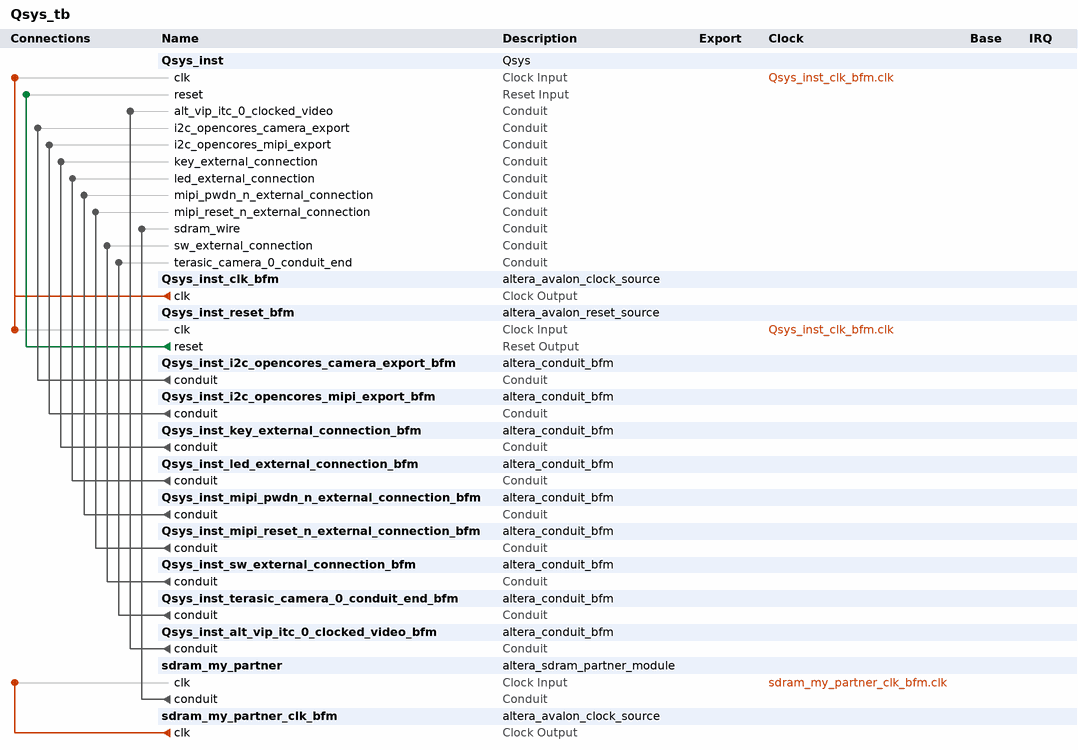
[diagram p0: system contents]
# Platform Designer (Qsys) system Qsys_tb, Cyclone V 5CSEMA5F31C6
# Parameters at their usual value, and those the tool derives, are not listed.
package require -exact qsys 14.0
create_system Qsys_tb
set_project_property DEVICE_FAMILY {Cyclone V}
set_project_property DEVICE 5CSEMA5F31C6

add_instance Qsys_inst Qsys 1.0

add_instance Qsys_inst_clk_bfm altera_avalon_clock_source 14.0

add_instance Qsys_inst_reset_bfm altera_avalon_reset_source 14.0
set_instance_parameter_value Qsys_inst_reset_bfm ASSERT_HIGH_RESET 0
set_instance_parameter_value Qsys_inst_reset_bfm INITIAL_RESET_CYCLES 50

add_instance Qsys_inst_i2c_opencores_camera_export_bfm altera_conduit_bfm 14.0
set_instance_parameter_value Qsys_inst_i2c_opencores_camera_export_bfm CLOCKED_SIGNAL false
set_instance_parameter_value Qsys_inst_i2c_opencores_camera_export_bfm ENABLE_RESET false
set_instance_parameter_value Qsys_inst_i2c_opencores_camera_export_bfm SIGNAL_ROLES scl_pad_io,sda_pad_io
set_instance_parameter_value Qsys_inst_i2c_opencores_camera_export_bfm SIGNAL_WIDTHS 1,1
set_instance_parameter_value Qsys_inst_i2c_opencores_camera_export_bfm SIGNAL_DIRECTIONS bidir,bidir

add_instance Qsys_inst_i2c_opencores_mipi_export_bfm altera_conduit_bfm 14.0
set_instance_parameter_value Qsys_inst_i2c_opencores_mipi_export_bfm CLOCKED_SIGNAL false
set_instance_parameter_value Qsys_inst_i2c_opencores_mipi_export_bfm ENABLE_RESET false
set_instance_parameter_value Qsys_inst_i2c_opencores_mipi_export_bfm SIGNAL_ROLES scl_pad_io,sda_pad_io
set_instance_parameter_value Qsys_inst_i2c_opencores_mipi_export_bfm SIGNAL_WIDTHS 1,1
set_instance_parameter_value Qsys_inst_i2c_opencores_mipi_export_bfm SIGNAL_DIRECTIONS bidir,bidir

add_instance Qsys_inst_key_external_connection_bfm altera_conduit_bfm 14.0
set_instance_parameter_value Qsys_inst_key_external_connection_bfm CLOCKED_SIGNAL false
set_instance_parameter_value Qsys_inst_key_external_connection_bfm ENABLE_RESET false
set_instance_parameter_value Qsys_inst_key_external_connection_bfm SIGNAL_WIDTHS 4
set_instance_parameter_value Qsys_inst_key_external_connection_bfm SIGNAL_DIRECTIONS output

add_instance Qsys_inst_led_external_connection_bfm altera_conduit_bfm 14.0
set_instance_parameter_value Qsys_inst_led_external_connection_bfm CLOCKED_SIGNAL false
set_instance_parameter_value Qsys_inst_led_external_connection_bfm ENABLE_RESET false
set_instance_parameter_value Qsys_inst_led_external_connection_bfm SIGNAL_WIDTHS 10
set_instance_parameter_value Qsys_inst_led_external_connection_bfm SIGNAL_DIRECTIONS input

add_instance Qsys_inst_mipi_pwdn_n_external_connection_bfm altera_conduit_bfm 14.0
set_instance_parameter_value Qsys_inst_mipi_pwdn_n_external_connection_bfm CLOCKED_SIGNAL false
set_instance_parameter_value Qsys_inst_mipi_pwdn_n_external_connection_bfm ENABLE_RESET false
set_instance_parameter_value Qsys_inst_mipi_pwdn_n_external_connection_bfm SIGNAL_WIDTHS 1
set_instance_parameter_value Qsys_inst_mipi_pwdn_n_external_connection_bfm SIGNAL_DIRECTIONS input

add_instance Qsys_inst_mipi_reset_n_external_connection_bfm altera_conduit_bfm 14.0
set_instance_parameter_value Qsys_inst_mipi_reset_n_external_connection_bfm CLOCKED_SIGNAL false
set_instance_parameter_value Qsys_inst_mipi_reset_n_external_connection_bfm ENABLE_RESET false
set_instance_parameter_value Qsys_inst_mipi_reset_n_external_connection_bfm SIGNAL_WIDTHS 1
set_instance_parameter_value Qsys_inst_mipi_reset_n_external_connection_bfm SIGNAL_DIRECTIONS input

add_instance Qsys_inst_sw_external_connection_bfm altera_conduit_bfm 14.0
set_instance_parameter_value Qsys_inst_sw_external_connection_bfm CLOCKED_SIGNAL false
set_instance_parameter_value Qsys_inst_sw_external_connection_bfm ENABLE_RESET false
set_instance_parameter_value Qsys_inst_sw_external_connection_bfm SIGNAL_WIDTHS 10
set_instance_parameter_value Qsys_inst_sw_external_connection_bfm SIGNAL_DIRECTIONS output

add_instance Qsys_inst_terasic_camera_0_conduit_end_bfm altera_conduit_bfm 14.0
set_instance_parameter_value Qsys_inst_terasic_camera_0_conduit_end_bfm CLOCKED_SIGNAL false
set_instance_parameter_value Qsys_inst_terasic_camera_0_conduit_end_bfm ENABLE_RESET false
set_instance_parameter_value Qsys_inst_terasic_camera_0_conduit_end_bfm SIGNAL_ROLES D,FVAL,LVAL,PIXCLK
set_instance_parameter_value Qsys_inst_terasic_camera_0_conduit_end_bfm SIGNAL_WIDTHS 12,1,1,1
set_instance_parameter_value Qsys_inst_terasic_camera_0_conduit_end_bfm SIGNAL_DIRECTIONS output,output,output,output

add_instance Qsys_inst_alt_vip_itc_0_clocked_video_bfm altera_conduit_bfm 14.0
set_instance_parameter_value Qsys_inst_alt_vip_itc_0_clocked_video_bfm CLOCKED_SIGNAL false
set_instance_parameter_value Qsys_inst_alt_vip_itc_0_clocked_video_bfm ENABLE_RESET false
set_instance_parameter_value Qsys_inst_alt_vip_itc_0_clocked_video_bfm SIGNAL_ROLES vid_clk,vid_data,underflow,vid_datavalid,vid_v_sync,vid_h_sync,vid_f,vid_h,vid_v
set_instance_parameter_value Qsys_inst_alt_vip_itc_0_clocked_video_bfm SIGNAL_WIDTHS 1,24,1,1,1,1,1,1,1
set_instance_parameter_value Qsys_inst_alt_vip_itc_0_clocked_video_bfm SIGNAL_DIRECTIONS output,input,input,input,input,input,input,input,input

add_instance sdram_my_partner altera_sdram_partner_module 11.0
set_instance_parameter_value sdram_my_partner SDRAM_DATA_WIDTH 16
set_instance_parameter_value sdram_my_partner SDRAM_COL_WIDTH 10
set_instance_parameter_value sdram_my_partner SDRAM_ROW_WIDTH 13
set_instance_parameter_value sdram_my_partner CONTR_NAME Qsys_sdram

add_instance sdram_my_partner_clk_bfm altera_avalon_clock_source 14.0
set_instance_parameter_value sdram_my_partner_clk_bfm CLOCK_RATE 100000000

# connections
add_connection Qsys_inst_clk_bfm.clk Qsys_inst.clk clock
add_connection Qsys_inst_clk_bfm.clk Qsys_inst_reset_bfm.clk clock
add_connection sdram_my_partner_clk_bfm.clk sdram_my_partner.clk clock
add_connection Qsys_inst_reset_bfm.reset Qsys_inst.reset reset
add_connection Qsys_inst_alt_vip_itc_0_clocked_video_bfm.conduit Qsys_inst.alt_vip_itc_0_clocked_video conduit
add_connection Qsys_inst_i2c_opencores_camera_export_bfm.conduit Qsys_inst.i2c_opencores_camera_export conduit
add_connection Qsys_inst_i2c_opencores_mipi_export_bfm.conduit Qsys_inst.i2c_opencores_mipi_export conduit
add_connection Qsys_inst_key_external_connection_bfm.conduit Qsys_inst.key_external_connection conduit
add_connection Qsys_inst_led_external_connection_bfm.conduit Qsys_inst.led_external_connection conduit
add_connection Qsys_inst_mipi_pwdn_n_external_connection_bfm.conduit Qsys_inst.mipi_pwdn_n_external_connection conduit
add_connection Qsys_inst_mipi_reset_n_external_connection_bfm.conduit Qsys_inst.mipi_reset_n_external_connection conduit
add_connection Qsys_inst_sw_external_connection_bfm.conduit Qsys_inst.sw_external_connection conduit
add_connection Qsys_inst_terasic_camera_0_conduit_end_bfm.conduit Qsys_inst.terasic_camera_0_conduit_end conduit
add_connection sdram_my_partner.conduit Qsys_inst.sdram_wire conduit

set_interconnect_requirement {$system} qsys_mm.clockCrossingAdapter HANDSHAKE
set_interconnect_requirement {$system} qsys_mm.maxAdditionalLatency 1
set_interconnect_requirement {$system} qsys_mm.insertDefaultSlave FALSE

save_system Qsys_tb.qsys
